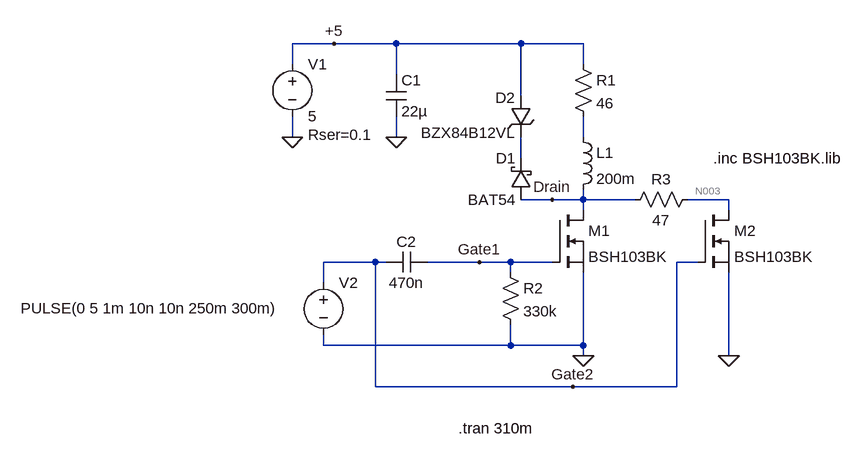
[diagram p0: schematic relay_driver.asc]
relay_driver.asc, the LTspice schematic file:
Version 4
SHEET 1 880 680
WIRE -96 48 -160 48
WIRE 0 48 -96 48
WIRE 192 48 0 48
WIRE 288 48 192 48
WIRE -160 80 -160 48
WIRE 288 80 288 48
WIRE 0 96 0 48
WIRE 192 128 192 48
WIRE -160 192 -160 160
WIRE 0 192 0 160
WIRE 288 192 288 160
WIRE 192 224 192 192
WIRE 240 288 192 288
WIRE 288 288 288 272
WIRE 288 288 240 288
WIRE 368 288 288 288
WIRE 512 288 448 288
WIRE 288 304 288 288
WIRE 512 304 512 288
WIRE -32 384 -112 384
WIRE -16 384 -32 384
WIRE 128 384 48 384
WIRE 176 384 128 384
WIRE 240 384 176 384
WIRE 464 384 432 384
WIRE 176 400 176 384
WIRE -112 416 -112 384
WIRE -112 512 -112 496
WIRE 176 512 176 480
WIRE 176 512 -112 512
WIRE 288 512 288 400
WIRE 288 512 176 512
WIRE 288 528 288 512
WIRE 512 528 512 400
WIRE -32 576 -32 384
WIRE 272 576 -32 576
WIRE 432 576 432 384
WIRE 432 576 272 576
FLAG 288 528 0
FLAG -96 48 +5
FLAG 240 288 Drain
FLAG -160 192 0
FLAG 0 192 0
FLAG 128 384 Gate1
FLAG 512 528 0
FLAG 272 576 Gate2
SYMBOL res 272 64 R0
SYMATTR InstName R1
SYMATTR Value 46
SYMBOL ind 272 176 R0
SYMATTR InstName L1
SYMATTR Value 200m
SYMBOL nmos 240 304 R0
SYMATTR InstName M1
SYMATTR Value BSH103BK
SYMATTR Prefix X
SYMBOL res 160 384 R0
SYMATTR InstName R2
SYMATTR Value 330k
SYMBOL voltage -160 64 R0
WINDOW 123 0 0 Left 0
WINDOW 39 24 124 Left 2
SYMATTR SpiceLine Rser=0.1
SYMATTR InstName V1
SYMATTR Value 5
SYMBOL voltage -112 400 R0
WINDOW 3 -466 55 Left 2
WINDOW 123 0 0 Left 0
WINDOW 39 0 0 Left 0
SYMATTR Value PULSE(0 5 1m 10n 10n 250m 300m)
SYMATTR InstName V2
SYMBOL schottky 208 288 R180
WINDOW 0 24 64 Left 2
WINDOW 3 24 0 Left 2
SYMATTR InstName D1
SYMATTR Value BAT54
SYMATTR Description Diode
SYMATTR Type diode
SYMBOL zener 176 128 R0
WINDOW 0 -23 3 Left 2
WINDOW 3 -138 57 Left 2
SYMATTR InstName D2
SYMATTR Value BZX84B12VL
SYMATTR Description Diode
SYMATTR Type diode
SYMBOL cap -16 96 R0
SYMATTR InstName C1
SYMATTR Value 22µ
SYMATTR SpiceLine Rser=0.2
SYMBOL nmos 464 304 R0
SYMATTR InstName M2
SYMATTR Value BSH103BK
SYMATTR Prefix X
SYMBOL res 464 272 R90
WINDOW 0 0 56 VBottom 2
WINDOW 3 32 56 VTop 2
SYMATTR InstName R3
SYMATTR Value 47
SYMBOL cap 48 368 R90
WINDOW 0 0 32 VBottom 2
WINDOW 3 32 32 VTop 2
SYMATTR InstName C2
SYMATTR Value 470n
TEXT 96 640 Left 2 !.tran 310m
TEXT 488 224 Left 2 !.inc BSH103BK.lib

The netlist it stands for:
* relay_driver.asc
R1 +5 N001 46
L1 N001 Drain 200m
XM1 Drain Gate1 0 BSH103BK  ; pins D G S
R2 Gate1 0 330k
V1 +5 0 5 Rser=0.1
V2 Gate2 0 PULSE(0 5 1m 10n 10n 250m 300m)
D1 Drain N002 BAT54
D2 +5 N002 BZX84B12VL
C1 +5 0 22µ Rser=0.2
XM2 N003 Gate2 0 BSH103BK  ; pins D G S
R3 N003 Drain 47
C2 Gate1 Gate2 470n
.model D D
.lib standard.dio
.tran 310m
.inc BSH103BK.lib
.backanno
.end

* Results of the author's LTspice run, read from the files saved beside the schematic
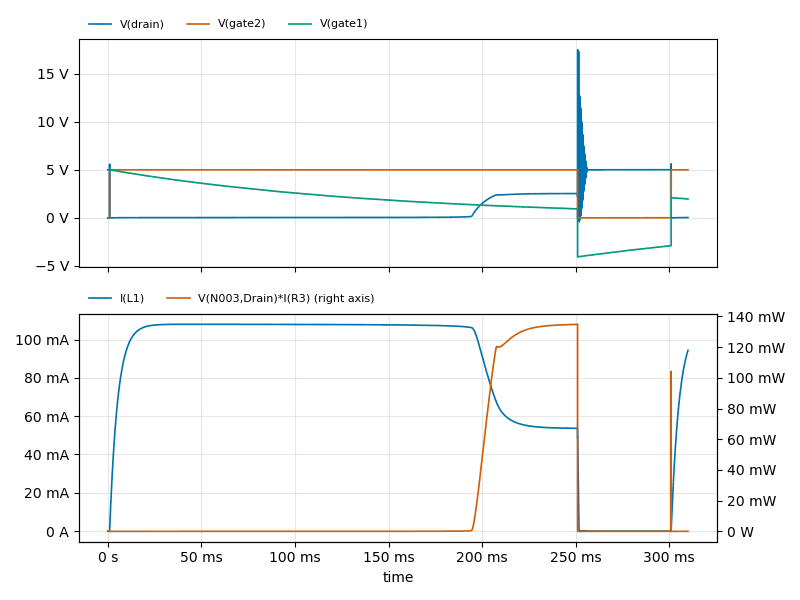
[diagram p1: Transient Analysis of relay_driver.asc, plotted from the saved traces]
* Transient Analysis, 1 run:
*   V(drain): min -426.1 mV, max 17.49 V, average 1.29 V, rms 2.43 V, last 30.9 mV
*   V(gate2): min 0 V, max 5 V, average 4.177 V, rms 4.57 V, last 5 V
*   V(gate1): min -4.061 V, max 4.999 V, average 1.46 V, rms 2.81 V, last 1.97 V
*   I(L1): min -141.7 µA, max 107.9 mA, average 79.15 mA, rms 88.92 mA, last 94.38 mA
*   V(N003,Drain)*I(R3): min 0 W, max 134.9 mW, average 20.81 mW, rms 51.03 mW, last 20.14 µW